# EAGLE design PortBreakoutCapacitive_r4_no_user (EAGLE 9.6.2)
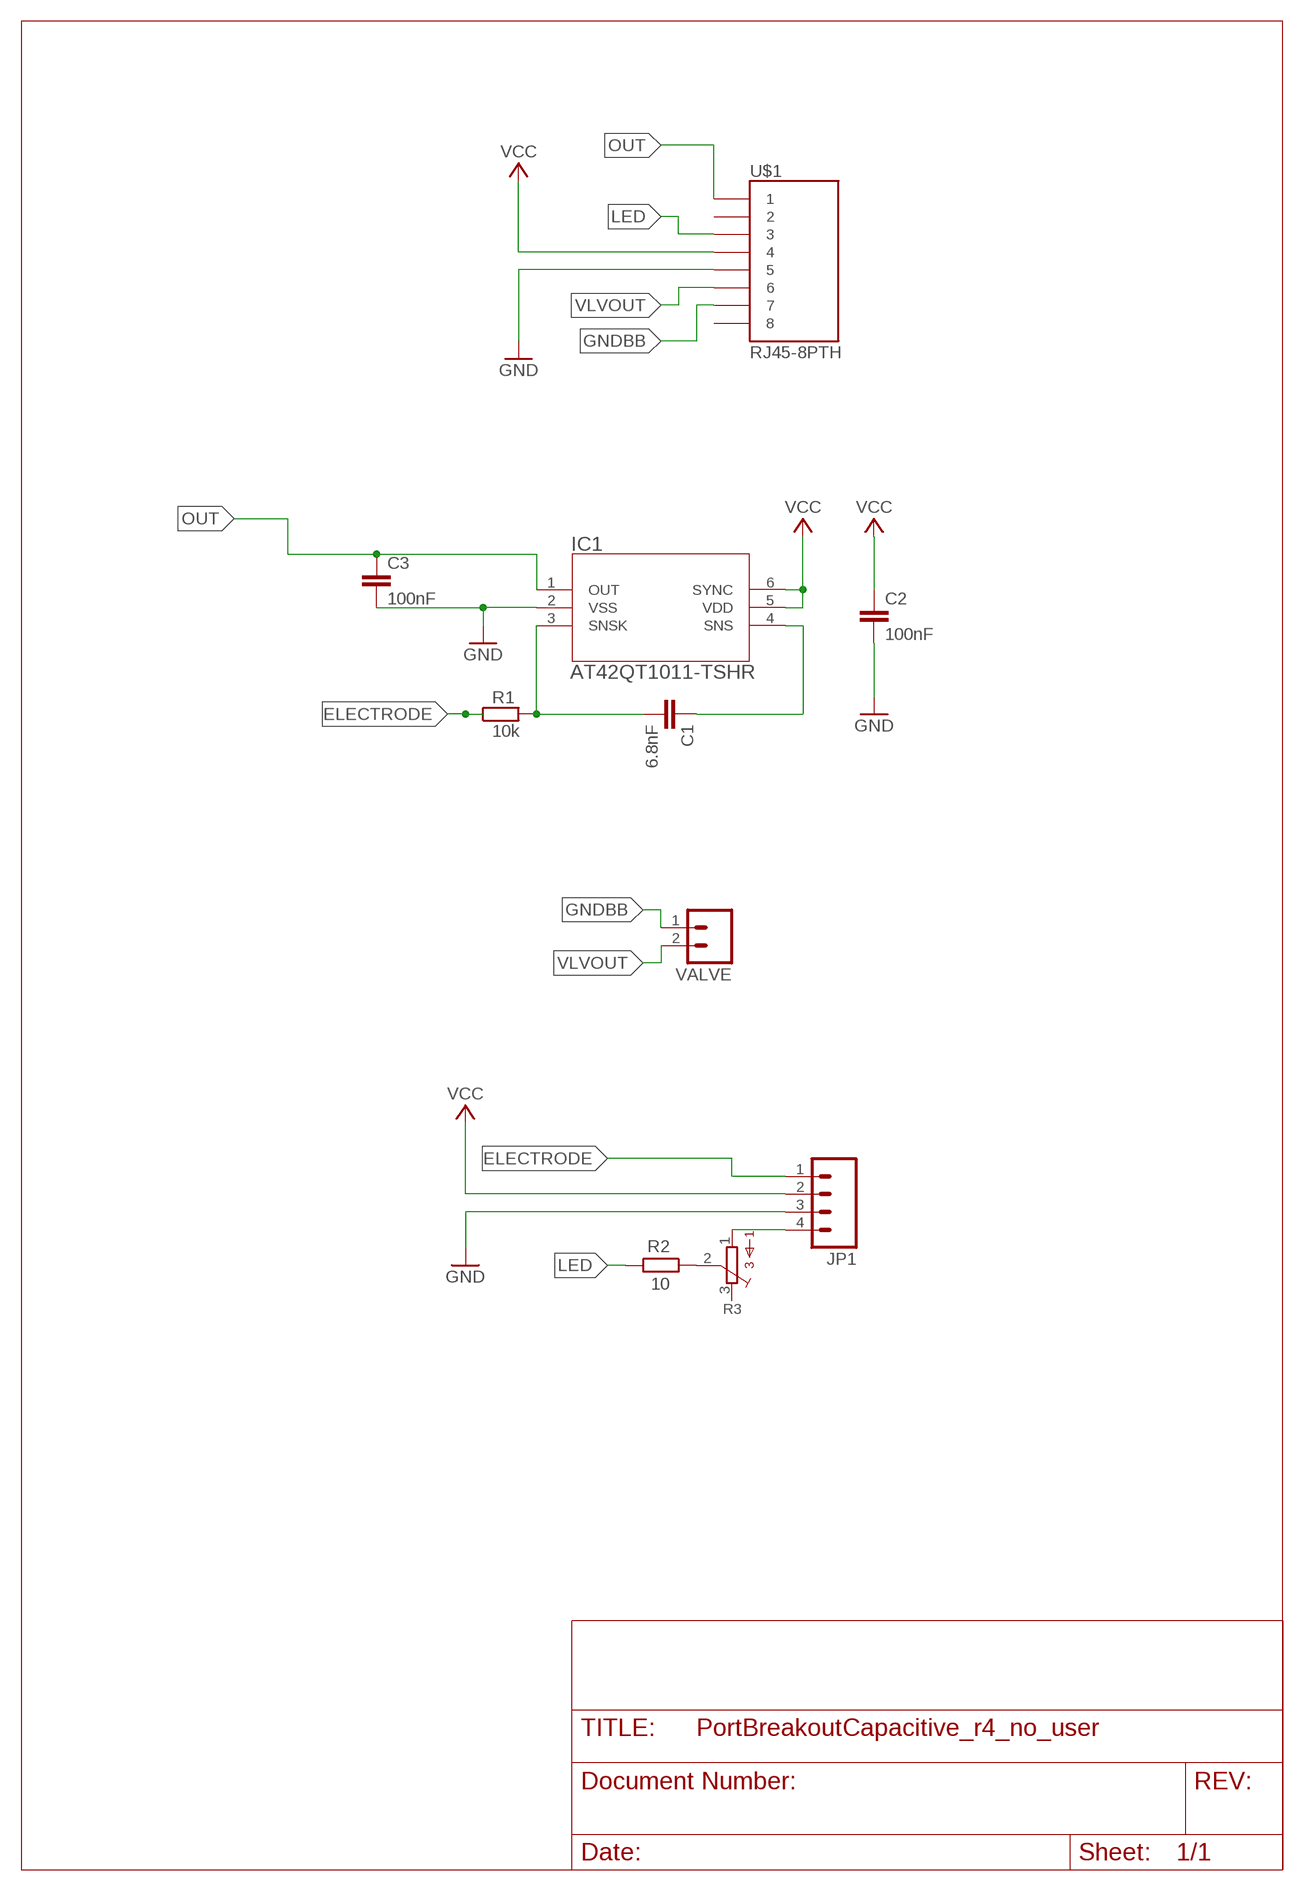
[diagram p0: schematic, sheet 1]

## Parts
C1  6.8nF  C-EUC1206  [C1206]
C2  100nF  C-EUC1206  [C1206]
C3  100nF  C-EUC1206  [C1206]
IC1  AT42QT1011-TSHR  AT42QT1010-TSHR  [6ST1_ATM]
JP1  CONN_04SCREW  [SCREWTERMINAL-3.5MM-4]
R1  10k  R-EU_R1206  [R1206]
R2  10  R-EU_R1206  [R1206]
R3  3362R  [3362R]
U$1  RJ45-8PTH  [RJ45-8]
VALVE  M023.5MM_LOCK  [SCREWTERMINAL-3.5MM-2_LOCK]

## Nets
ELECTRODE: JP1.1 R1.1
GND: C2.2 C3.2 IC1.2(VSS) JP1.3 U$1.5
GNDBB: U$1.7 VALVE.1
LED: R2.2 U$1.3
N$4: R2.1 R3.2
N$7: JP1.4 R3.1
OUT: C3.1 IC1.1(OUT) U$1.1
SNS: C1.1 IC1.4(SNS)
SNSK: C1.2 IC1.3(SNSK) R1.2
VCC: C2.1 IC1.5(VDD) IC1.6(SYNC) JP1.2 U$1.4
VLVOUT: U$1.6 VALVE.2
Unconnected: R3.3 U$1.2 U$1.8

## Library data of the parts
C1-C3 = rcl:C-EU: CAPACITOR, European symbol; SPICEPREFIX: C
IC1 = flo:AT42QT1010-TSHR; BUILT_BY: EMA_UL_Team; MANUFACTURER_PART_NUMBER: AT42QT1010-TSHR; SOURCELIBRARY: Atmel_2011-04-02; VENDOR: Atmel
JP1 = SparkFun-Connectors:CONN_04: Multi connection point. Often used as Generic Header-pin footprint for 0.1 inch spaced/style header connections On any of the 0.1 inch spaced packages, you can populate with these: Break Away Headers - Straight <https://www.sparkfun.com/products/116> (PRT-00116) Break Away Male Headers - Right Angle <https://www.sparkfun.com/products/553> (PRT-00553) Female Headers <https://www.sparkfun.com/products/115> (PRT-00115) Break Away Headers - Machine Pin <https://www.sparkfun.com/products/117> (PRT-00117) Break Away Female Headers - Swiss Machine Pin <https://www.sparkfun.com/products/743> (PRT-00743) For SCREWTERMINALS and SPRING TERMINALS visit here: Screw Terimnals on SparkFun.com <https://www.sparkfun.com/search/results?term=Screw+Terminals> (5mm/3.5mm/2.54mm spacing) This device is also useful as a general connection point to wire up your design to another part of your project. Our various solder wires solder well into these plated through hole pads. Hook-Up Wire - Assortment (Stranded, 22 AWG) <https://www.sparkfun.com/products/11375> (PRT-11375) Hook-Up Wire - Assortment (Solid Core, 22 AWG) <https://www.sparkfun.com/products/11367> (PRT-11367) View the entire wire category on our website here <https://www.sparkfun.com/categories/141> Special notes: Molex polarized connector foot print use with SKU : PRT-08231 with associated crimp pins and housings. 1MM SMD Version SKU: PRT-10208; PROD_ID: 2xCONN-08399; SF_ID: 2xPRT-08084
R1 R2 = rcl:R-EU_: RESISTOR, European symbol; SPICEPREFIX: R
R3 = bourns:3362: 3362 Series 1/4" Square Trimmer
U$1 = SparkFun:RJ45-8: RJ45 Jack Simple RJ45, 8-pin connection - connector for common Cat5, Cat5e, and Cat6 Ethernet cables. Footprint not yet proven in production. Connector sku is PRT-00643; Breakout PCB sku is BOB-00716.
VALVE = SparkFun:M02: Header 2 Standard 2-pin 0.1" header. Use with straight break away headers (SKU : PRT-00116), right angle break away headers (PRT-00553), swiss pins (PRT-00743), machine pins (PRT-00117), and female headers (PRT-00115). Molex polarized connector foot print use with SKU : PRT-08233 with associated crimp pins and housings.

## Board
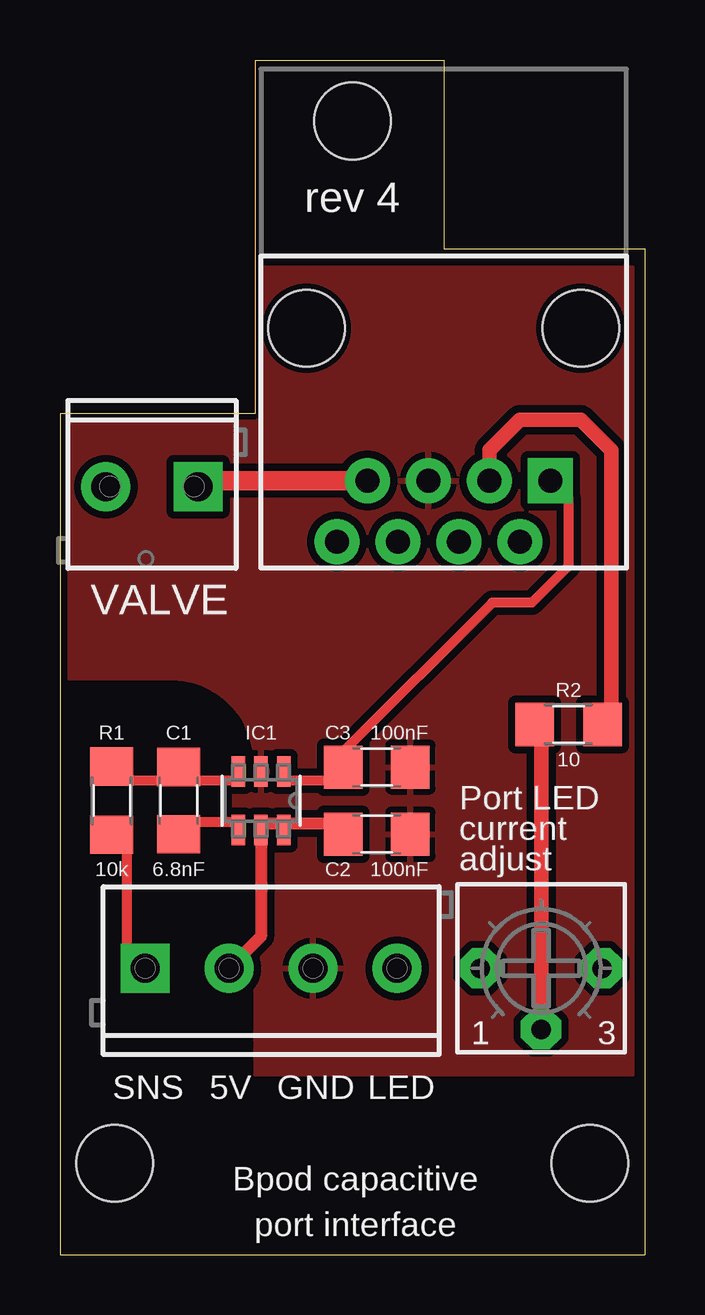
[diagram p1: board, top side]
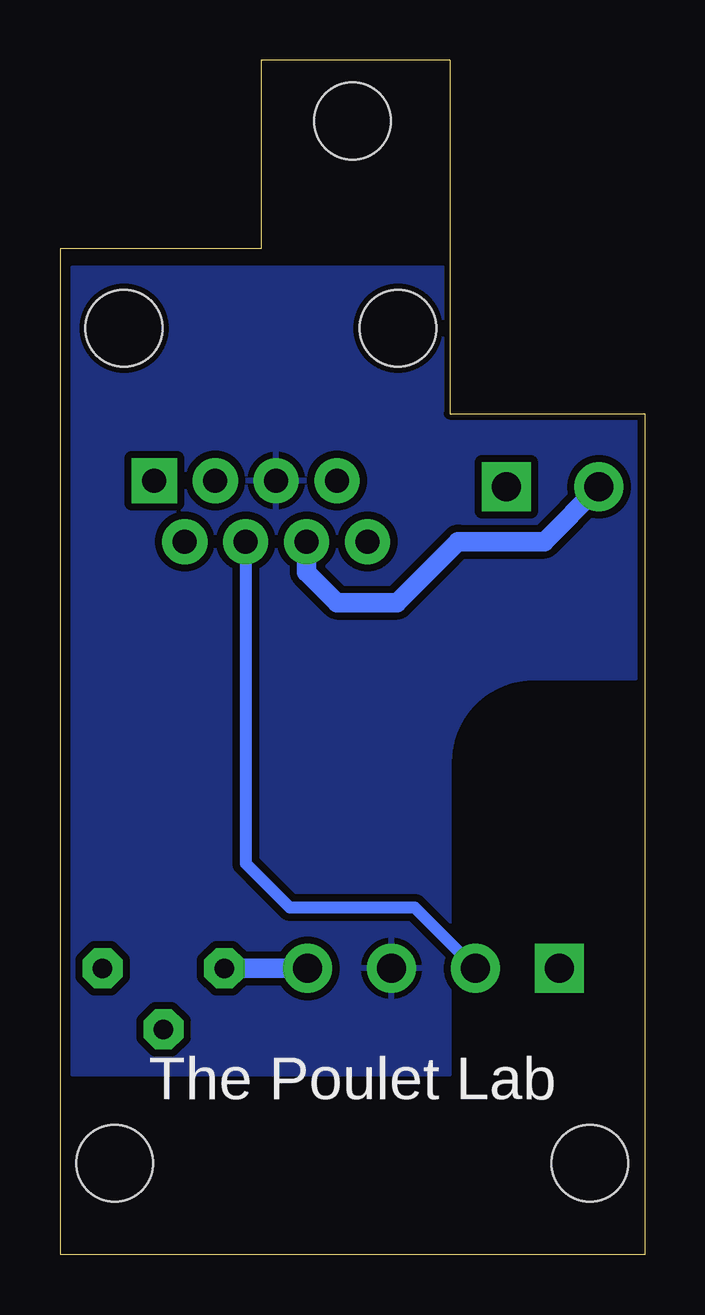
[diagram p2: board, bottom side, seen from below]

Size 24.38 x 49.78 mm. Coordinates in mm from the lower left corner, seen from the top.
Outline: 0,0 24.38,0 24.38,41.91 16,41.91 16,49.78 8.13,49.78 8.13,35.05 0,35.05 0,0
Copper layers (1*16): Top 0.035mm / dielectric 1.5mm / Bottom 0.035mm
Design rules "SeeedStudio_2layer_DRU_no_angle_20140221 *": minimum track width 6mil, minimum drill 12mil, track to track 12mil, track to pad 12mil, pad to pad 12mil, via to via 12mil, smd to smd 0mil, copper to edge 10mil, drill to drill 10mil, minimum pad ring 10mil, minimum via ring 6mil, stop-mask expansion 2mil, vias tented up to drill 100mil, thermal gap 10mil
Holes 3.2 mm at 12.19,47.24 22.1,3.81 2.29,3.81

### Footprints (pad centres in the part's own frame; a part is rotated, then mirrored left to right if it is on the bottom)
C1206 = smd 1.6 x 1.8: 1 -1.4,0; 2 1.4,0
6ST1_ATM = smd 1.27 x 0.559: 1 -1.219,0.95; 2 -1.219,0; 3 -1.219,-0.95; 4 1.219,-0.95; 5 1.219,0; 6 1.219,0.95
SCREWTERMINAL-3.5MM-4 = drill 1.2 pad 2.032 square: 1 0,0 | drill 1.2 pad 2.032: 2 3.5,0; 3 7,0; 4 10.5,0
R1206 = smd 1.6 x 1.803: 1 -1.422,0; 2 1.422,0
3362R = drill 0.813 pad 1.676 octagon: 1 -2.54,0; 2 0,-2.54; 3 2.54,0
RJ45-8 = drill 1 pad 1.88 square: 1 -4.445,6.35 | drill 1 pad 1.88: 2 -3.175,8.89; 3 -1.905,6.35; 4 -0.635,8.89; 5 0.635,6.35; 6 1.905,8.89; 7 3.175,6.35; 8 4.445,8.89 | hole 3.2: -5.715,0; 5.715,0
SCREWTERMINAL-3.5MM-2_LOCK = drill 1.2 pad 2.032 square: 1 -0.178,0 | drill 1.2 pad 2.032: 2 3.678,0

### Placement (x,y rotation side)
C1  4.95,18.92 90 top
C2  13.21,17.53 0 top
C3  13.21,20.32 0 top
IC1  8.38,18.92 270 top
JP1  3.56,11.94 0 top
R1  2.16,18.92 90 top
R2  21.21,22.1 0 top
R3  20.07,11.94 0 top
U$1  16,38.61 180 top
VALVE  5.59,32 180 top

### Tracks (layer width: path | path; a pad name or v marks a point on that pad's centre or on a via)
ELECTRODE
  Top 0.406: R1.1 2.79,16.87 2.79,12.7 JP1.1
GND
  pour Bottom: 0.38,41.15 0.38,24 4.61,24 arc-90 8.13,20.49 8.13,7.49 23.88,7.49 23.88,41.15
  pour Top: 8.13,19.76 7.24,19.76 7.24,18.03 8.13,18.03 8.13,7.49 23.88,7.49 23.88,41.15 0.38,41.15 0.38,24 4.64,24 arc-90 8.13,20.51
GNDBB
  Top 0.813: U$1.7 6.02,32.26 VALVE.1
LED
  Top 0.61: 22.99,22.25 22.99,33.53 21.72,34.8 19.18,34.8 17.91,33.53 U$1.3
  Top 0.813: R2.2 22.84,22.1 22.99,22.25
N$4
  Top 0.61: 20.07,21.97 R3.2
  Top 0.813: R2.1 19.94,22.09 20.07,21.97
N$7
  Bottom 0.813: R3.1 JP1.4
OUT
  Top 0.406: U$1.1 21.21,31.5 21.21,28.7 19.68,27.18 18.03,27.18 11.81,20.95 C3.1 11.25,19.76 9.33,19.76 IC1.1
SNS
  Top 0.406: IC1.4 7.43,18.03 4.95,18.03 C1.1
SNSK
  Top 0.406: C1.2 4.95,19.76 | 4.95,19.76 2.16,19.76 R1.2 | IC1.3 7.43,19.76 4.95,19.76
VCC
  Top 0.508: IC1.6 9.33,17.96 | 9.33,17.96 8.38,17.96 IC1.5 8.38,13.26 JP1.2 | C2.1 11.81,17.96 9.33,17.96
  Bottom 0.508: U$1.4 16.64,16.31 14.8,14.48 9.6,14.48 JP1.2
VLVOUT
  Bottom 0.813: U$1.6 14.1,28.45 12.83,27.18 10.33,27.18 7.79,29.72 4.2,29.72 VALVE.2

### Text on the board
tPlace: rev 4 | Port LED | current | adjust | SNS | 5V | GND | LED | Bpod capacitive | port interface
bNames: The Poulet Lab
Measures: Dimensions given are in inches.